# Altium schematic sheet BatteryRecharge2.SchDoc
size Letter
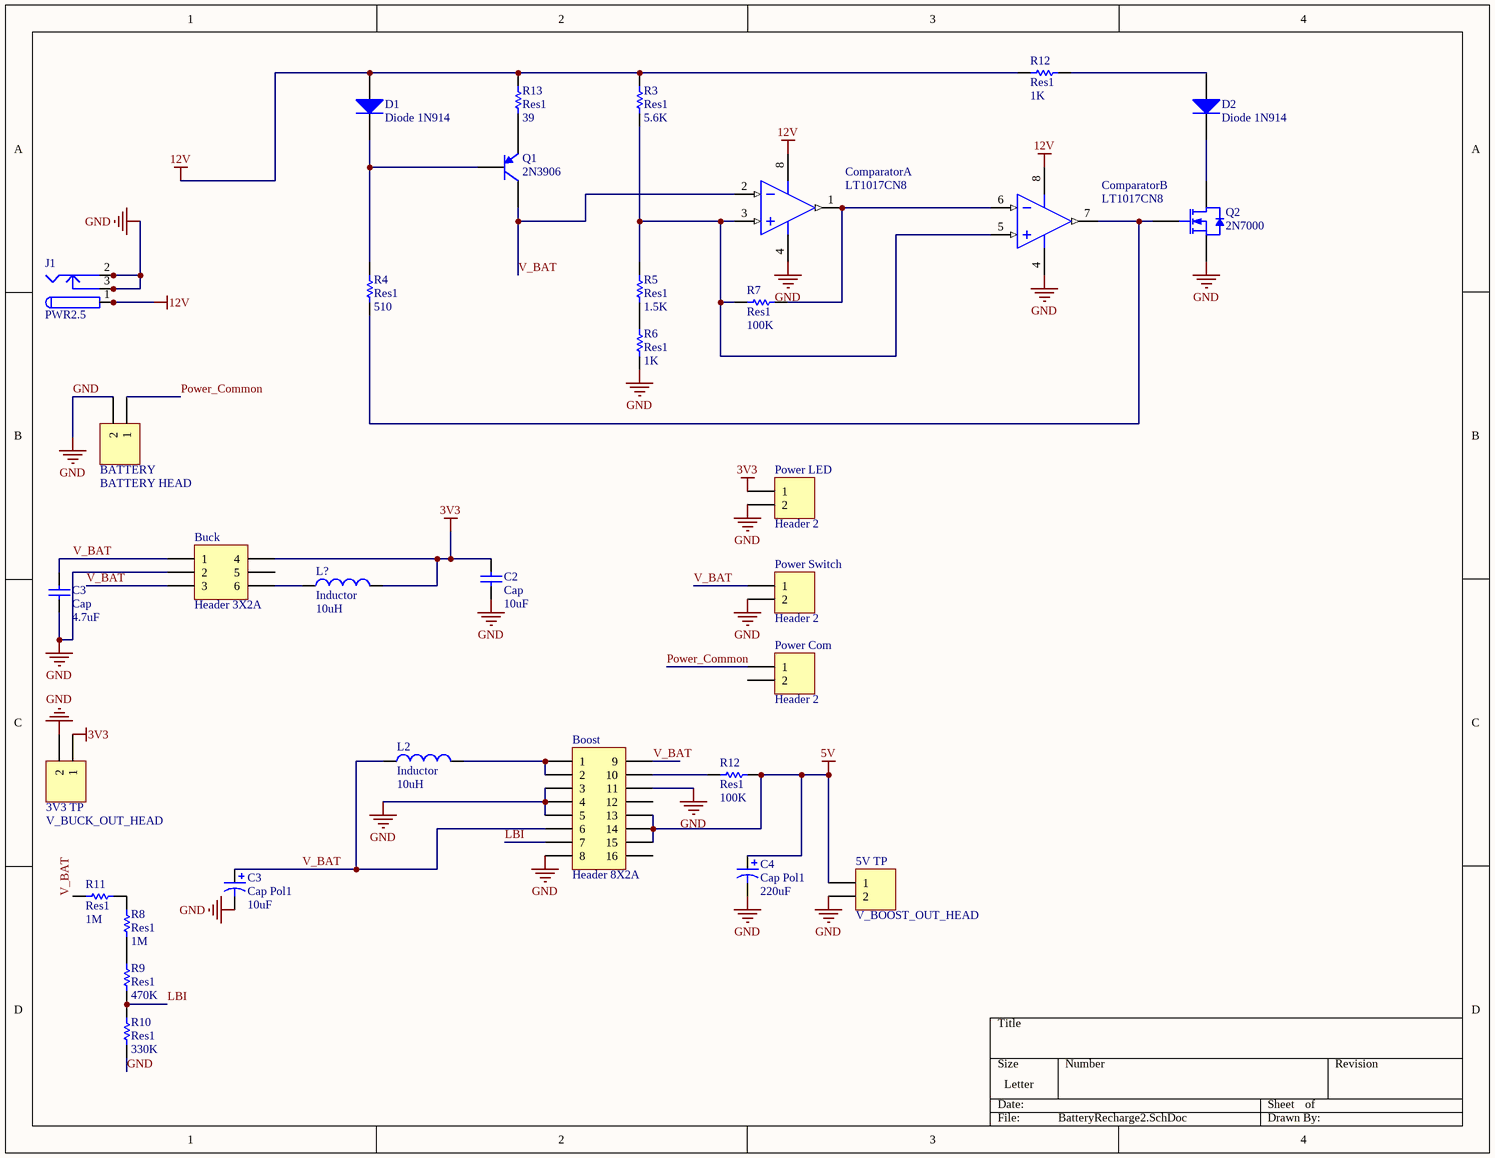
[diagram p0: BatteryRecharge2.SchDoc]

## Parts
(Parts that share a designator on the sheet are numbered #1, #2 ... from top to bottom, then left to right.)
3V3_TP  V_BUCK_OUT_HEAD  [HDR1X2]
5V_TP  V_BOOST_OUT_HEAD  [HDR1X2]
BATTERY  BATTERY HEAD  [HDR1X2]
Boost  Header 8X2A  [SSOP16_M]
Buck  Header 3X2A  [SOT23-6_M]
C2  Cap  value 10uF  [6-0805_M]
C3#1  Cap  value 4.7uF  [6-0805_M]
C3#2  Cap Pol1  value 10uF  [6-0805_M]
C4  Cap Pol1  value 220uF  [RB7.6-15]
Comparator  LT1017CN8  [LT-N8]  (parts A,B of 2)
D1  Diode 1N914  [DO-35]
D2  Diode 1N914  [DO-35]
J1  PWR2.5  [KLD-0202]
L2  Inductor  value 10uH  [AXIAL-0.3]
L?  Inductor  value 10uH  [AXIAL-0.3]
Power_Com  Header 2  [HDR1X2]
Power_LED  Header 2  [HDR1X2]
Power_Switch  Header 2  [HDR1X2]
Q1  2N3906  [TO-92A]
Q2  2N7000  [SOT54]
R3  Res1  value 5.6K  [6-0805_M]
R4  Res1  value 510  [6-0805_M]
R5  Res1  value 1.5K  [6-0805_M]
R6  Res1  value 1K  [6-0805_M]
R7  Res1  value 100K  [6-0805_M]
R8  Res1  value 1M  [6-0805_M]
R9  Res1  value 470K  [6-0805_M]
R10  Res1  value 330K  [6-0805_M]
R11  Res1  value 1M  [6-0805_M]
R12#1  Res1  value 1K  [6-0805_M]
R12#2  Res1  value 100K  [6-0805_M]
R13  Res1  value 39  [6-0805_M]

## Nets
3V3: 3V3_TP.1 Buck.4 C2.2 L?.2 Power_LED.1
5V: 5V_TP.1 Boost.13 Boost.14 Boost.15 C4.1 R12#2.1
12V: Comparator.8(V+) D1.1(A) J1.1 J1.1A J1.1B R3.2 R12#1.1 R13.2
GND: 3V3_TP.2 5V_TP.2 BATTERY.2 Boost.3 Boost.4 Boost.5 Boost.8 Boost.11 Buck.2 C2.1 C3#1.1 C3#2.2 C4.2 Comparator.4(V-) J1.2 J1.2A J1.2B J1.3 J1.3A J1.3B Power_LED.2 Power_Switch.2 Q2.3(S) R6.1 R10.1
LBI: Boost.7 R9.1 R10.2
Power_Common: BATTERY.1 Power_Com.1
V_BAT: Boost.6 Boost.9 Buck.1 Buck.3 C3#1.2 C3#2.1 Comparator.2(-INA) L2.1 Power_Switch.1 Q1.3(C) R11.2
NetBoost_1: Boost.1 Boost.2 L2.2
NetBoost_10: Boost.10 R12#2.2
NetBuck_6: Buck.6 L?.1
NetComparator_1: Comparator.1(OUTPUTA) Comparator.6(-INB) R7.2
NetComparator_3: Comparator.3(+INA) Comparator.5(+INB) R3.1 R5.2 R7.1
NetComparator_7: Comparator.7(OUTPUTB) Q2.2(G) R4.1
NetD1_2: D1.2(K) Q1.2(B) R4.2
NetD2_1: D2.1(A) R12#1.2
NetD2_2: D2.2(K) Q2.1(D)
NetQ1_1: Q1.1(E) R13.1
NetR5_1: R5.1 R6.2
NetR8_1: R8.1 R9.2
NetR8_2: R8.2 R11.1

Not connected (* = marked no-connect by the designer): Boost 12 16; Buck 5; Power_Com 2

## Library data of the parts
3V3_TP 5V_TP BATTERY Power_Com Power_LED Power_Switch = Header 2: Header, 2-Pin; LatestRevisionDate: 17-Jul-2002; LatestRevisionNote: Re-released for DXP Platform.; Publisher: Altium Limited
Boost = Header 8X2A: Header, 8-Pin, Dual row; LatestRevisionDate: 17-Jul-2002; LatestRevisionNote: Re-released for DXP Platform.; Publisher: Altium Limited
Buck = Header 3X2A: Header, 3-Pin, Dual row; LatestRevisionDate: 17-Jul-2002; LatestRevisionNote: Re-released for DXP Platform.; Publisher: Altium Limited
C2 C3#1 = Cap: Capacitor; Published: 8-Jun-2000; LatestRevisionDate: 17-Jul-2002; LatestRevisionNote: Re-released for DXP Platform.; PackageReference: RAD-0.3; Publisher: Altium Limited; PackageDescription: Radial Cap, Thru-Hole; 2 Leads; 0.3 in Pin Spacing
C3#2 C4 = Cap Pol1: Polarized Capacitor (Radial); Published: 8-Jun-2000; LatestRevisionDate: 17-Jul-2002; LatestRevisionNote: Re-released for DXP Platform.; PackageReference: RB7.6-15; Publisher: Altium Limited; PackageDescription: Polarized Capacitor (Radial); 2 Leads
Comparator = LT1017CN8: Micropower Comparator, 2 Channels, 1.2 to 40 V, 0 to +70 degC, 8-pin PDIP (N8); Generic Part Number: LT1017; Manufacturer: Linear Technology; Channels (#): 2; Prop Delay (us): 22; Supply Current (uA) Guaranteed: 60; Supply Current (uA) Typical: 30; Vos (mV) Guaranteed: 1; Vos (mV) Typical: 0.4; Vs Max (V): 40; Vs Min (V): 1.2; DatasheetVersion: Rev F; PackageReference: N8; PackageDescription: 8-Pin PDIP, Row Spacing 7.62, Pitch 2.54 mm; Supplier 1: Digi-Key; Supplier Part Number 1: LT1017CN8-ND; Supplier 2: Newark; Supplier Part Number 2: 57M0864; Features: Comparator; RoHS: N; Supply Voltage Range: 1.2 to 40 V; Mounting Technology: Through Hole; PartNumber: LT1017CN8; ComponentLink1Description: Manufacturer URL; ComponentLink1URL: http://www.linear.com/; ComponentLink2Description: Datasheet; ComponentLink2URL: http://cds.linear.com/docs/en/datasheet/10178ff.pdf; ComponentLink3Description: Package Specification; ComponentLink3URL: http://cds.linear.com/docs/en/packaging/05081510_I_N8.pdf
D1 D2 = Diode 1N914: High Conductance Fast Diode; Published: 8-Jun-2000; LatestRevisionDate: 17-Jul-2002; LatestRevisionNote: Re-released for DXP Platform.; DatasheetVersion: 1997; PackageReference: DO-35; Publisher: Altium Limited; PackageDescription: Diode, Axial; Body 3.8 x 1.9 mm (LxDia. max), Lead Dia. 0.53 mm (max); Code_JEDEC: DO-204-AH; ComponentLink1Description: Manufacturer Link; ComponentLink1URL: http://www.fairchildsemi.com/; ComponentLink2Description: Datasheet; ComponentLink2URL: http://www.fairchildsemi.com/ds/1N%2F1N4448.pdf
J1 = PWR2.5: Low Voltage Power Supply Connector; Published: 17-Dec-2003; DatasheetDocument: 09-May-2002; Publisher: Altium Limited; ComponentLink1Description: Manufacturer Link; ComponentLink1URL: http://domino.kycon.com/internet/Products.html
L2 L? = Inductor: Code_IEC: 1005; Published: 8-Jun-2000; LatestRevisionDate: 29-May-2009; LatestRevisionNote: IPC-7351 Footprint Added.; PackageReference: 0402-A; Publisher: Altium Limited; PackageDescription: Chip Inductor; Code_JEITA: 0402
Q1 = 2N3906: PNP General Purpose Amplifier; Published: 8-Jun-2000; LatestRevisionDate: 15-Jan-2003; LatestRevisionNote: PCB Footprint 'BCY-W3/D4.7' replaced; DatasheetVersion: 1997; PackageVersion: Sep-1998; PackageReference: TO-92A; Publisher: Altium Limited; PackageDescription: TO, Flat Index; 3 In-Line, Axial Leads; Body Dia. 4.5mm; Leads 0.51 x 0.48 mm (max); ComponentLink1Description: Manufacturer Link; ComponentLink1URL: http://www.fairchildsemi.com/; ComponentLink2Description: Datasheet; ComponentLink2URL: http://www.fairchildsemi.com/ds/2N%2F2N3906.pdf
Q2 = 2N7000: N-channel Enhancement Mode Field-effect Transistor; Published: 17-Sep-2003; LatestRevisionDate: 12-Dec-2006; LatestRevisionNote: Footprint pad sequence fixed.; DatasheetVersion: 19-May-2000; PackageVersion: Feb-1997; PackageReference: SOT54; Publisher: Altium Limited; PackageDescription: Plastic Single-Ended Leaded (through hole) package; 3 Leads (TO-92); Code_JEITA: SC-43; Code_JEDEC: TO-92; ComponentLink1Description: Manufacturer Link; ComponentLink1URL: http://www.semiconductors.philips.com/; ComponentLink2Description: Datasheet; ComponentLink2URL: http://www.semiconductors.philips.com/acrobat/datasheets/2N7000-03.pdf
R3-R11 R12#1 R12#2 R13 = Res1: Resistor; Published: 8-Jun-2000; LatestRevisionDate: 17-Jul-2002; LatestRevisionNote: Re-released for DXP Platform.; PackageReference: AXIAL-0.3; Publisher: Altium Limited; PackageDescription: Axial Device, Thru-Hole; 2 Leads; 0.3 in Pin Spacing